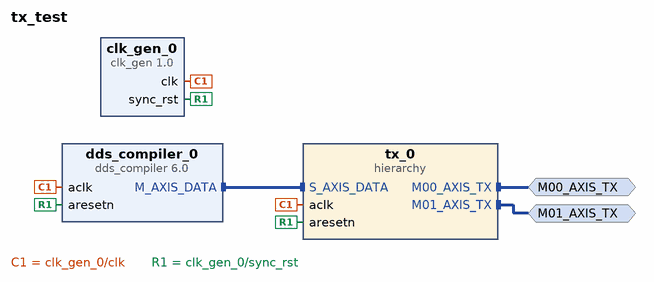
[diagram p0: block diagram of the top level]
# Vivado block design tx_test, Vivado 2015.2
create_bd_design tx_test

create_bd_intf_port -mode Master -vlnv xilinx.com:interface:axis_rtl:1.0 M00_AXIS_TX
set_property -dict [list \
  CONFIG.FREQ_HZ 125000000 \
  CONFIG.CLK_DOMAIN ps_processing_system7_0_0_FCLK_CLK0 \
] [get_bd_intf_ports M00_AXIS_TX]
create_bd_intf_port -mode Master -vlnv xilinx.com:interface:axis_rtl:1.0 M01_AXIS_TX
set_property -dict [list \
  CONFIG.FREQ_HZ 125000000 \
  CONFIG.CLK_DOMAIN ps_processing_system7_0_0_FCLK_CLK0 \
] [get_bd_intf_ports M01_AXIS_TX]

create_bd_cell -type hier tx_0
create_bd_cell -type ip -vlnv xilinx.com:ip:dds_compiler:6.0 dds_compiler_0
set_property -dict [list \
  CONFIG.DDS_Clock_Rate 125 \
  CONFIG.Spurious_Free_Dynamic_Range 95 \
  CONFIG.Frequency_Resolution 0.2 \
  CONFIG.Noise_Shaping Auto \
  CONFIG.Phase_Width 30 \
  CONFIG.Output_Width 16 \
  CONFIG.Phase_Increment Fixed \
  CONFIG.Has_Phase_Out false \
  CONFIG.DATA_Has_TLAST Not_Required \
  CONFIG.Has_TREADY true \
  CONFIG.S_PHASE_Has_TUSER Not_Required \
  CONFIG.M_DATA_Has_TUSER Not_Required \
  CONFIG.Latency 10 \
  CONFIG.Has_ARESETn true \
  CONFIG.Output_Frequency1 0.02 \
  CONFIG.PINC1 101001111100010110 \
] [get_bd_cells dds_compiler_0]
create_bd_cell -type ip -vlnv xilinx.com:ip:clk_gen:1.0 clk_gen_0

# ---- hierarchy /tx_0 ----
current_bd_instance /tx_0
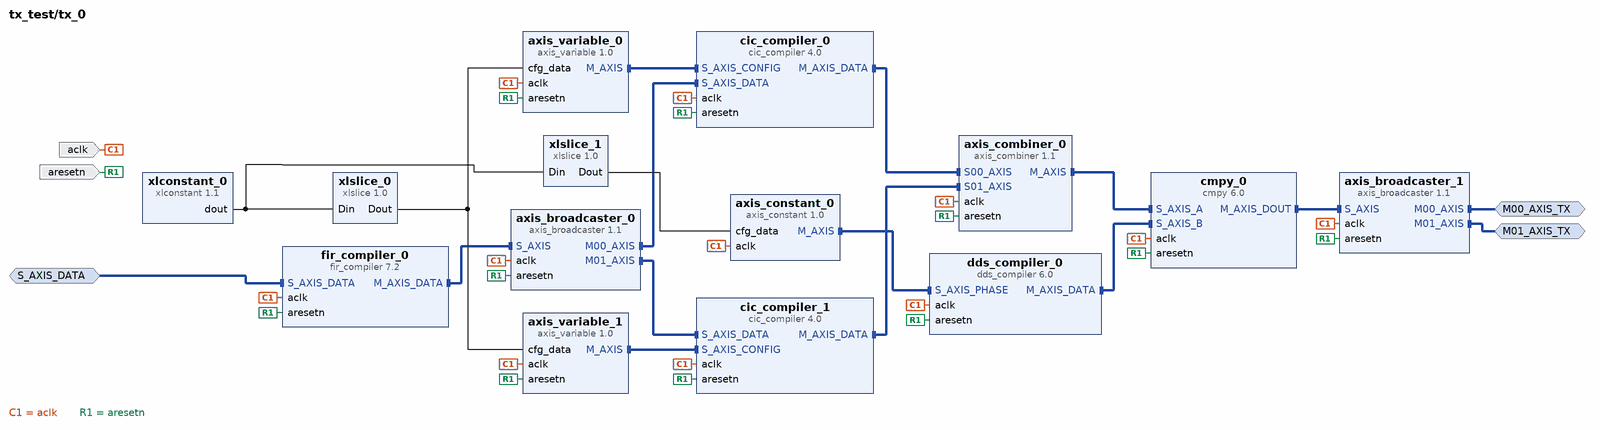
[diagram p1: block diagram inside /tx_0]
create_bd_intf_pin -mode Master -vlnv xilinx.com:interface:axis_rtl:1.0 M00_AXIS_TX
create_bd_intf_pin -mode Master -vlnv xilinx.com:interface:axis_rtl:1.0 M01_AXIS_TX
create_bd_intf_pin -mode Slave -vlnv xilinx.com:interface:axis_rtl:1.0 S_AXIS_DATA
create_bd_pin -dir I aclk
create_bd_pin -dir I aresetn

create_bd_cell -type ip -vlnv xilinx.com:ip:cmpy:6.0 cmpy_0
set_property -dict [list \
  CONFIG.APortWidth 24 \
  CONFIG.BPortWidth 24 \
  CONFIG.FlowControl Blocking \
  CONFIG.OutputWidth 18 \
  CONFIG.MinimumLatency 12 \
  CONFIG.ARESETN true \
] [get_bd_cells cmpy_0]
create_bd_cell -type ip -vlnv xilinx.com:ip:cic_compiler:4.0 cic_compiler_0
set_property -dict [list \
  CONFIG.Number_Of_Stages 5 \
  CONFIG.Sample_Rate_Changes Programmable \
  CONFIG.Fixed_Or_Initial_Rate 625 \
  CONFIG.Minimum_Rate 125 \
  CONFIG.Maximum_Rate 3125 \
  CONFIG.Input_Sample_Frequency 1 \
  CONFIG.Clock_Frequency 125 \
  CONFIG.SamplePeriod 125 \
  CONFIG.Input_Data_Width 24 \
  CONFIG.Quantization Truncation \
  CONFIG.Output_Data_Width 24 \
  CONFIG.Use_Xtreme_DSP_Slice false \
  CONFIG.HAS_ARESETN true \
  CONFIG.HAS_DOUT_TREADY true \
] [get_bd_cells cic_compiler_0]
create_bd_cell -type ip -vlnv xilinx.com:ip:cic_compiler:4.0 cic_compiler_1
set_property -dict [list \
  CONFIG.Number_Of_Stages 5 \
  CONFIG.Sample_Rate_Changes Programmable \
  CONFIG.Fixed_Or_Initial_Rate 625 \
  CONFIG.Minimum_Rate 125 \
  CONFIG.Maximum_Rate 3125 \
  CONFIG.Input_Sample_Frequency 1 \
  CONFIG.Clock_Frequency 125 \
  CONFIG.SamplePeriod 125 \
  CONFIG.Input_Data_Width 24 \
  CONFIG.Quantization Truncation \
  CONFIG.Output_Data_Width 24 \
  CONFIG.Use_Xtreme_DSP_Slice false \
  CONFIG.HAS_ARESETN true \
  CONFIG.HAS_DOUT_TREADY true \
] [get_bd_cells cic_compiler_1]
create_bd_cell -type ip -vlnv xilinx.com:ip:axis_combiner:1.1 axis_combiner_0
set_property -dict {CONFIG.TDATA_NUM_BYTES 3} [get_bd_cells axis_combiner_0]
create_bd_cell -type ip -vlnv xilinx.com:ip:axis_broadcaster:1.1 axis_broadcaster_0
set_property -dict [list \
  CONFIG.M_TDATA_NUM_BYTES 3 \
  CONFIG.S_TDATA_NUM_BYTES 8 \
  CONFIG.HAS_TREADY 1 \
  CONFIG.M00_TDATA_REMAP {tdata[23:0]} \
  CONFIG.M01_TDATA_REMAP {tdata[55:32]} \
] [get_bd_cells axis_broadcaster_0]
create_bd_cell -type ip -vlnv xilinx.com:ip:dds_compiler:6.0 dds_compiler_0
set_property -dict [list \
  CONFIG.DDS_Clock_Rate 125 \
  CONFIG.Spurious_Free_Dynamic_Range 138 \
  CONFIG.Frequency_Resolution 0.2 \
  CONFIG.Noise_Shaping Auto \
  CONFIG.Phase_Width 30 \
  CONFIG.Output_Width 24 \
  CONFIG.Phase_Increment Streaming \
  CONFIG.Has_Phase_Out false \
  CONFIG.DATA_Has_TLAST Not_Required \
  CONFIG.S_PHASE_Has_TUSER Not_Required \
  CONFIG.M_DATA_Has_TUSER Not_Required \
  CONFIG.Latency 10 \
  CONFIG.Has_ARESETn true \
  CONFIG.Output_Frequency1 0 \
  CONFIG.PINC1 0 \
] [get_bd_cells dds_compiler_0]
create_bd_cell -type ip -vlnv xilinx.com:ip:xlslice:1.0 xlslice_0
set_property -dict {CONFIG.DOUT_WIDTH 16 CONFIG.DIN_TO 0 CONFIG.DIN_FROM 15 CONFIG.DIN_WIDTH 64} [get_bd_cells xlslice_0]
create_bd_cell -type ip -vlnv pavel-demin:user:axis_variable:1.0 axis_variable_0
set_property -dict {CONFIG.AXIS_TDATA_WIDTH 16} [get_bd_cells axis_variable_0]
create_bd_cell -type ip -vlnv pavel-demin:user:axis_variable:1.0 axis_variable_1
set_property -dict {CONFIG.AXIS_TDATA_WIDTH 16} [get_bd_cells axis_variable_1]
create_bd_cell -type ip -vlnv pavel-demin:user:axis_constant:1.0 axis_constant_0
create_bd_cell -type ip -vlnv xilinx.com:ip:xlslice:1.0 xlslice_1
set_property -dict {CONFIG.DOUT_WIDTH 32 CONFIG.DIN_TO 32 CONFIG.DIN_FROM 63 CONFIG.DIN_WIDTH 64} [get_bd_cells xlslice_1]
create_bd_cell -type ip -vlnv xilinx.com:ip:fir_compiler:7.2 fir_compiler_0
set_property -dict [list \
  CONFIG.CoefficientVector {-1.64776395523261e-08, -4.73223982493382e-08, -7.93114097748734e-10, 3.09341607494277e-08, 1.86268604565617e-08, 3.27485571200346e-08, -6.29908653657968e-09, -1.52279861575043e-07, -8.30460847858456e-08, 3.14535491822606e-07, 3.05626738325402e-07, -4.74172694219994e-07, -7.13495049416347e-07, 5.47323968241002e-07, 1.33462183148789e-06, -4.14140755019506e-07, -2.15051006195781e-06, -6.77410015715413e-08, 3.07546485446303e-06, 1.03702255417565e-06, -3.94436393706816e-06, -2.59191311589838e-06, 4.51537519422448e-06, 4.74782575774399e-06, -4.49284245797096e-06, -7.39824596121288e-06, 3.57216304293944e-06, 1.0289531398643e-05, -1.50382000963687e-06, -1.30208669437029e-05, -1.8320780740752e-06, 1.50781578706169e-05, 6.35464869916574e-06, -1.5905693254477e-05, -1.17324822432291e-05, 1.50110146034995e-05, 1.73719815499574e-05, -1.20943524633858e-05, -2.24668827259553e-05, 7.16974344173206e-06, 2.61032685003911e-05, -6.63576078703743e-07, -2.74292794572945e-05, -6.55062322922545e-06, 2.5864354889803e-05, 1.32043152416442e-05, -2.13170377303369e-05, -1.7790015052466e-05, 1.4366401658372e-05, 1.88196488042346e-05, -6.35769575620025e-06, -1.51624671610732e-05, -6.3454751890034e-07, 6.41574547942767e-06, 4.00779001049893e-06, 6.75760336386084e-06, -1.00538045567379e-06, -2.24030234065108e-05, -1.07626302618669e-05, 3.72333834565482e-05, 3.27008161208513e-05, -4.68605170112616e-05, -6.46526581514427e-05, 4.62599879903061e-05, 0.000104401861517261, -3.05403948192664e-05, -0.00014745720335074, -4.12013707266912e-06, 0.000187185910308468, 5.9472285269084e-05, -0.000215374917579779, -0.000134302073078784, 0.000223224152976694, 0.00022383529853513, -0.000202700646279518, -0.000319623716269056, 0.000148096208070561, 0.00041005036860653, -5.75597854424301e-05, -0.000481514995957391, -6.56763133492148e-05, 0.000520250999114949, 0.000212664164338231, -0.000514618719419215, -0.000369005842837135, 0.000457467389871147, 0.000515973656086604, -0.000348477939755869, -0.000632881279945779, 0.000195649794954827, 0.000700188749146281, -1.57992717633881e-05, -0.000703205392036612, -0.000166376697710665, 0.000635843920605569, 0.00032083226194399, -0.000503811084211153, -0.000416255319934634, 0.000326569991673316, 0.000425391875921946, -0.00013746695448704, -0.000331045335837557, -1.84322419198225e-05, 0.000131952870425038, 8.8991373620273e-05, 0.000152406451111629, -2.20059552576483e-05, -0.000479109327658611, -0.000226158943701414, 0.000781596108897923, 0.000680336287236396, -0.000973841573779158, -0.00133743086810108, 0.000957505429554979, 0.00215823795933061, -0.000633058497914659, -0.00306239583565753, -8.62773868301778e-05, 0.00392749237767837, 0.00125890086582158, -0.0045932013828814, -0.002899064621986, 0.00487080892138405, 0.00496271652177841, -0.00455788126865406, -0.00733667233358662, 0.00345716360480598, 0.00983253607996904, -0.00139819324342049, -0.0121861637129463, -0.00174034328863689, 0.014062282608939, 0.00600853672502155, -0.0150655751552465, -0.01137014160612, 0.0147483575782911, 0.0176872274320504, -0.0126185258485222, -0.0247131655485743, 0.00813090350262748, 0.0320864711007864, -0.000645151353472906, -0.0393170493516836, -0.0106924075067383, 0.0457366439777749, 0.0272501703222767, -0.0503214712404459, -0.0517158392679872, 0.0510195785361982, 0.0905708960358907, -0.0416085827802432, -0.163747940036716, -0.0107991247506511, 0.356391980570419, 0.554821620626239, 0.356391980570419, -0.0107991247506511, -0.163747940036716, -0.0416085827802432, 0.0905708960358907, 0.0510195785361982, -0.0517158392679871, -0.0503214712404459, 0.0272501703222767, 0.0457366439777748, -0.0106924075067384, -0.0393170493516836, -0.000645151353472902, 0.0320864711007864, 0.00813090350262744, -0.0247131655485743, -0.0126185258485222, 0.0176872274320504, 0.014748357578291, -0.01137014160612, -0.0150655751552464, 0.00600853672502154, 0.014062282608939, -0.00174034328863689, -0.0121861637129463, -0.0013981932434205, 0.00983253607996903, 0.00345716360480599, -0.00733667233358662, -0.00455788126865407, 0.00496271652177837, 0.00487080892138405, -0.00289906462198599, -0.0045932013828814, 0.00125890086582158, 0.00392749237767837, -8.62773868301858e-05, -0.00306239583565753, -0.000633058497914665, 0.00215823795933062, 0.000957505429554986, -0.00133743086810109, -0.00097384157377915, 0.000680336287236399, 0.000781596108897926, -0.000226158943701417, -0.000479109327658599, -2.20059552576474e-05, 0.000152406451111619, 8.89913736202697e-05, 0.000131952870425043, -1.84322419198184e-05, -0.000331045335837562, -0.000137466954487046, 0.000425391875921945, 0.000326569991673318, -0.000416255319934626, -0.000503811084211157, 0.000320832261943976, 0.000635843920605571, -0.000166376697710658, -0.000703205392036611, -1.57992717634175e-05, 0.000700188749146282, 0.000195649794954849, -0.00063288127994578, -0.000348477939755879, 0.000515973656086602, 0.000457467389871152, -0.000369005842837133, -0.00051461871941922, 0.00021266416433823, 0.00052025099911495, -6.5676313349214e-05, -0.000481514995957386, -5.75597854424309e-05, 0.00041005036860653, 0.000148096208070561, -0.000319623716269053, -0.000202700646279518, 0.00022383529853513, 0.000223224152976694, -0.000134302073078785, -0.000215374917579779, 5.94722852690836e-05, 0.000187185910308467, -4.1201370726696e-06, -0.000147457203350739, -3.05403948192655e-05, 0.00010440186151726, 4.62599879903048e-05, -6.46526581514424e-05, -4.68605170112612e-05, 3.27008161208512e-05, 3.72333834565472e-05, -1.07626302618669e-05, -2.24030234065122e-05, -1.00538045567376e-06, 6.75760336386114e-06, 4.00779001049914e-06, 6.41574547942654e-06, -6.34547518900236e-07, -1.51624671610739e-05, -6.35769575620011e-06, 1.88196488042347e-05, 1.43664016583718e-05, -1.77900150524658e-05, -2.13170377303367e-05, 1.32043152416438e-05, 2.58643548898028e-05, -6.55062322922483e-06, -2.74292794572945e-05, -6.63576078704085e-07, 2.61032685003909e-05, 7.16974344173231e-06, -2.24668827259554e-05, -1.20943524633859e-05, 1.73719815499574e-05, 1.50110146034996e-05, -1.1732482243229e-05, -1.59056932544774e-05, 6.35464869916573e-06, 1.5078157870617e-05, -1.83207807407521e-06, -1.30208669437035e-05, -1.50382000963686e-06, 1.02895313986436e-05, 3.57216304293944e-06, -7.39824596121333e-06, -4.49284245797099e-06, 4.74782575774417e-06, 4.51537519422448e-06, -2.59191311589829e-06, -3.94436393706815e-06, 1.03702255417562e-06, 3.07546485446302e-06, -6.77410015715271e-08, -2.15051006195779e-06, -4.14140755019505e-07, 1.33462183148789e-06, 5.47323968241007e-07, -7.13495049416342e-07, -4.7417269421995e-07, 3.05626738325399e-07, 3.1453549182257e-07, -8.30460847858442e-08, -1.52279861575044e-07, -6.29908653657931e-09, 3.27485571200189e-08, 1.86268604565597e-08, 3.09341607494308e-08, -7.93114097748315e-10, -4.73223982493358e-08, -1.64776395523266e-08} \
  CONFIG.Coefficient_Sets 1 \
  CONFIG.Filter_Type Interpolation \
  CONFIG.Interpolation_Rate 2 \
  CONFIG.Decimation_Rate 1 \
  CONFIG.Zero_Pack_Factor 1 \
  CONFIG.Number_Channels 1 \
  CONFIG.Number_Paths 2 \
  CONFIG.RateSpecification Frequency_Specification \
  CONFIG.Sample_Frequency 0.5 \
  CONFIG.Clock_Frequency 125 \
  CONFIG.Coefficient_Sign Signed \
  CONFIG.Quantization Quantize_Only \
  CONFIG.Coefficient_Width 24 \
  CONFIG.BestPrecision true \
  CONFIG.Coefficient_Fractional_Bits 23 \
  CONFIG.Coefficient_Structure Inferred \
  CONFIG.Data_Width 16 \
  CONFIG.Output_Rounding_Mode Truncate_LSBs \
  CONFIG.Output_Width 26 \
  CONFIG.Filter_Architecture Systolic_Multiply_Accumulate \
  CONFIG.M_DATA_Has_TREADY true \
  CONFIG.Has_ARESETn true \
] [get_bd_cells fir_compiler_0]
create_bd_cell -type ip -vlnv xilinx.com:ip:axis_broadcaster:1.1 axis_broadcaster_1
set_property -dict [list \
  CONFIG.M_TDATA_NUM_BYTES 2 \
  CONFIG.S_TDATA_NUM_BYTES 6 \
  CONFIG.M00_TDATA_REMAP {tdata[15:0]} \
  CONFIG.M01_TDATA_REMAP {tdata[39:24]} \
] [get_bd_cells axis_broadcaster_1]
create_bd_cell -type ip -vlnv xilinx.com:ip:xlconstant:1.1 xlconstant_0
set_property -dict {CONFIG.CONST_WIDTH 64 CONFIG.CONST_VAL 0x02949a560000007d} [get_bd_cells xlconstant_0]

# ---- connections ----

current_bd_instance /tx_0
connect_bd_intf_net [get_bd_intf_pins cic_compiler_0/M_AXIS_DATA] [get_bd_intf_pins axis_combiner_0/S00_AXIS]
connect_bd_intf_net [get_bd_intf_pins cic_compiler_1/M_AXIS_DATA] [get_bd_intf_pins axis_combiner_0/S01_AXIS]
connect_bd_intf_net [get_bd_intf_pins axis_combiner_0/M_AXIS] [get_bd_intf_pins cmpy_0/S_AXIS_A]
connect_bd_intf_net [get_bd_intf_pins axis_broadcaster_0/M00_AXIS] [get_bd_intf_pins cic_compiler_0/S_AXIS_DATA]
connect_bd_intf_net [get_bd_intf_pins axis_broadcaster_0/M01_AXIS] [get_bd_intf_pins cic_compiler_1/S_AXIS_DATA]
connect_bd_intf_net [get_bd_intf_pins dds_compiler_0/M_AXIS_DATA] [get_bd_intf_pins cmpy_0/S_AXIS_B]
connect_bd_intf_net [get_bd_intf_pins axis_variable_0/M_AXIS] [get_bd_intf_pins cic_compiler_0/S_AXIS_CONFIG]
connect_bd_intf_net [get_bd_intf_pins axis_variable_1/M_AXIS] [get_bd_intf_pins cic_compiler_1/S_AXIS_CONFIG]
connect_bd_intf_net [get_bd_intf_pins axis_constant_0/M_AXIS] [get_bd_intf_pins dds_compiler_0/S_AXIS_PHASE]
connect_bd_intf_net [get_bd_intf_pins axis_broadcaster_0/S_AXIS] [get_bd_intf_pins fir_compiler_0/M_AXIS_DATA]
connect_bd_intf_net [get_bd_intf_pins cmpy_0/M_AXIS_DOUT] [get_bd_intf_pins axis_broadcaster_1/S_AXIS]
connect_bd_intf_net [get_bd_intf_pins M00_AXIS_TX] [get_bd_intf_pins axis_broadcaster_1/M00_AXIS]
connect_bd_intf_net [get_bd_intf_pins M01_AXIS_TX] [get_bd_intf_pins axis_broadcaster_1/M01_AXIS]
connect_bd_intf_net [get_bd_intf_pins S_AXIS_DATA] [get_bd_intf_pins fir_compiler_0/S_AXIS_DATA]
connect_bd_net [get_bd_pins aclk] \
  [get_bd_pins cic_compiler_1/aclk] [get_bd_pins axis_broadcaster_0/aclk] [get_bd_pins cic_compiler_0/aclk] \
  [get_bd_pins axis_combiner_0/aclk] [get_bd_pins cmpy_0/aclk] [get_bd_pins dds_compiler_0/aclk] \
  [get_bd_pins axis_variable_1/aclk] [get_bd_pins axis_variable_0/aclk] [get_bd_pins axis_constant_0/aclk] \
  [get_bd_pins fir_compiler_0/aclk] [get_bd_pins axis_broadcaster_1/aclk]
connect_bd_net [get_bd_pins xlslice_0/Dout] [get_bd_pins axis_variable_0/cfg_data] [get_bd_pins axis_variable_1/cfg_data]
connect_bd_net -net axi_cfg_register_0_cfg_data [get_bd_pins xlconstant_0/dout] [get_bd_pins xlslice_0/Din] [get_bd_pins xlslice_1/Din]
connect_bd_net [get_bd_pins xlslice_1/Dout] [get_bd_pins axis_constant_0/cfg_data]
connect_bd_net [get_bd_pins aresetn] \
  [get_bd_pins axis_broadcaster_0/aresetn] [get_bd_pins axis_combiner_0/aresetn] [get_bd_pins axis_variable_0/aresetn] \
  [get_bd_pins axis_variable_1/aresetn] [get_bd_pins axis_broadcaster_1/aresetn] [get_bd_pins fir_compiler_0/aresetn] \
  [get_bd_pins cic_compiler_0/aresetn] [get_bd_pins cic_compiler_1/aresetn] [get_bd_pins dds_compiler_0/aresetn] \
  [get_bd_pins cmpy_0/aresetn]

current_bd_instance /
connect_bd_intf_net [get_bd_intf_pins dds_compiler_0/M_AXIS_DATA] [get_bd_intf_pins tx_0/S_AXIS_DATA]
connect_bd_intf_net [get_bd_intf_ports M00_AXIS_TX] [get_bd_intf_pins tx_0/M00_AXIS_TX]
connect_bd_intf_net [get_bd_intf_ports M01_AXIS_TX] [get_bd_intf_pins tx_0/M01_AXIS_TX]
connect_bd_net -net aclk_1 [get_bd_pins clk_gen_0/clk] [get_bd_pins dds_compiler_0/aclk] [get_bd_pins tx_0/aclk]
connect_bd_net -net aresetn_1 [get_bd_pins clk_gen_0/sync_rst] [get_bd_pins dds_compiler_0/aresetn] [get_bd_pins tx_0/aresetn]

validate_bd_design
save_bd_design
